# EAGLE design thermocouple_reader (EAGLE 6.5.0)
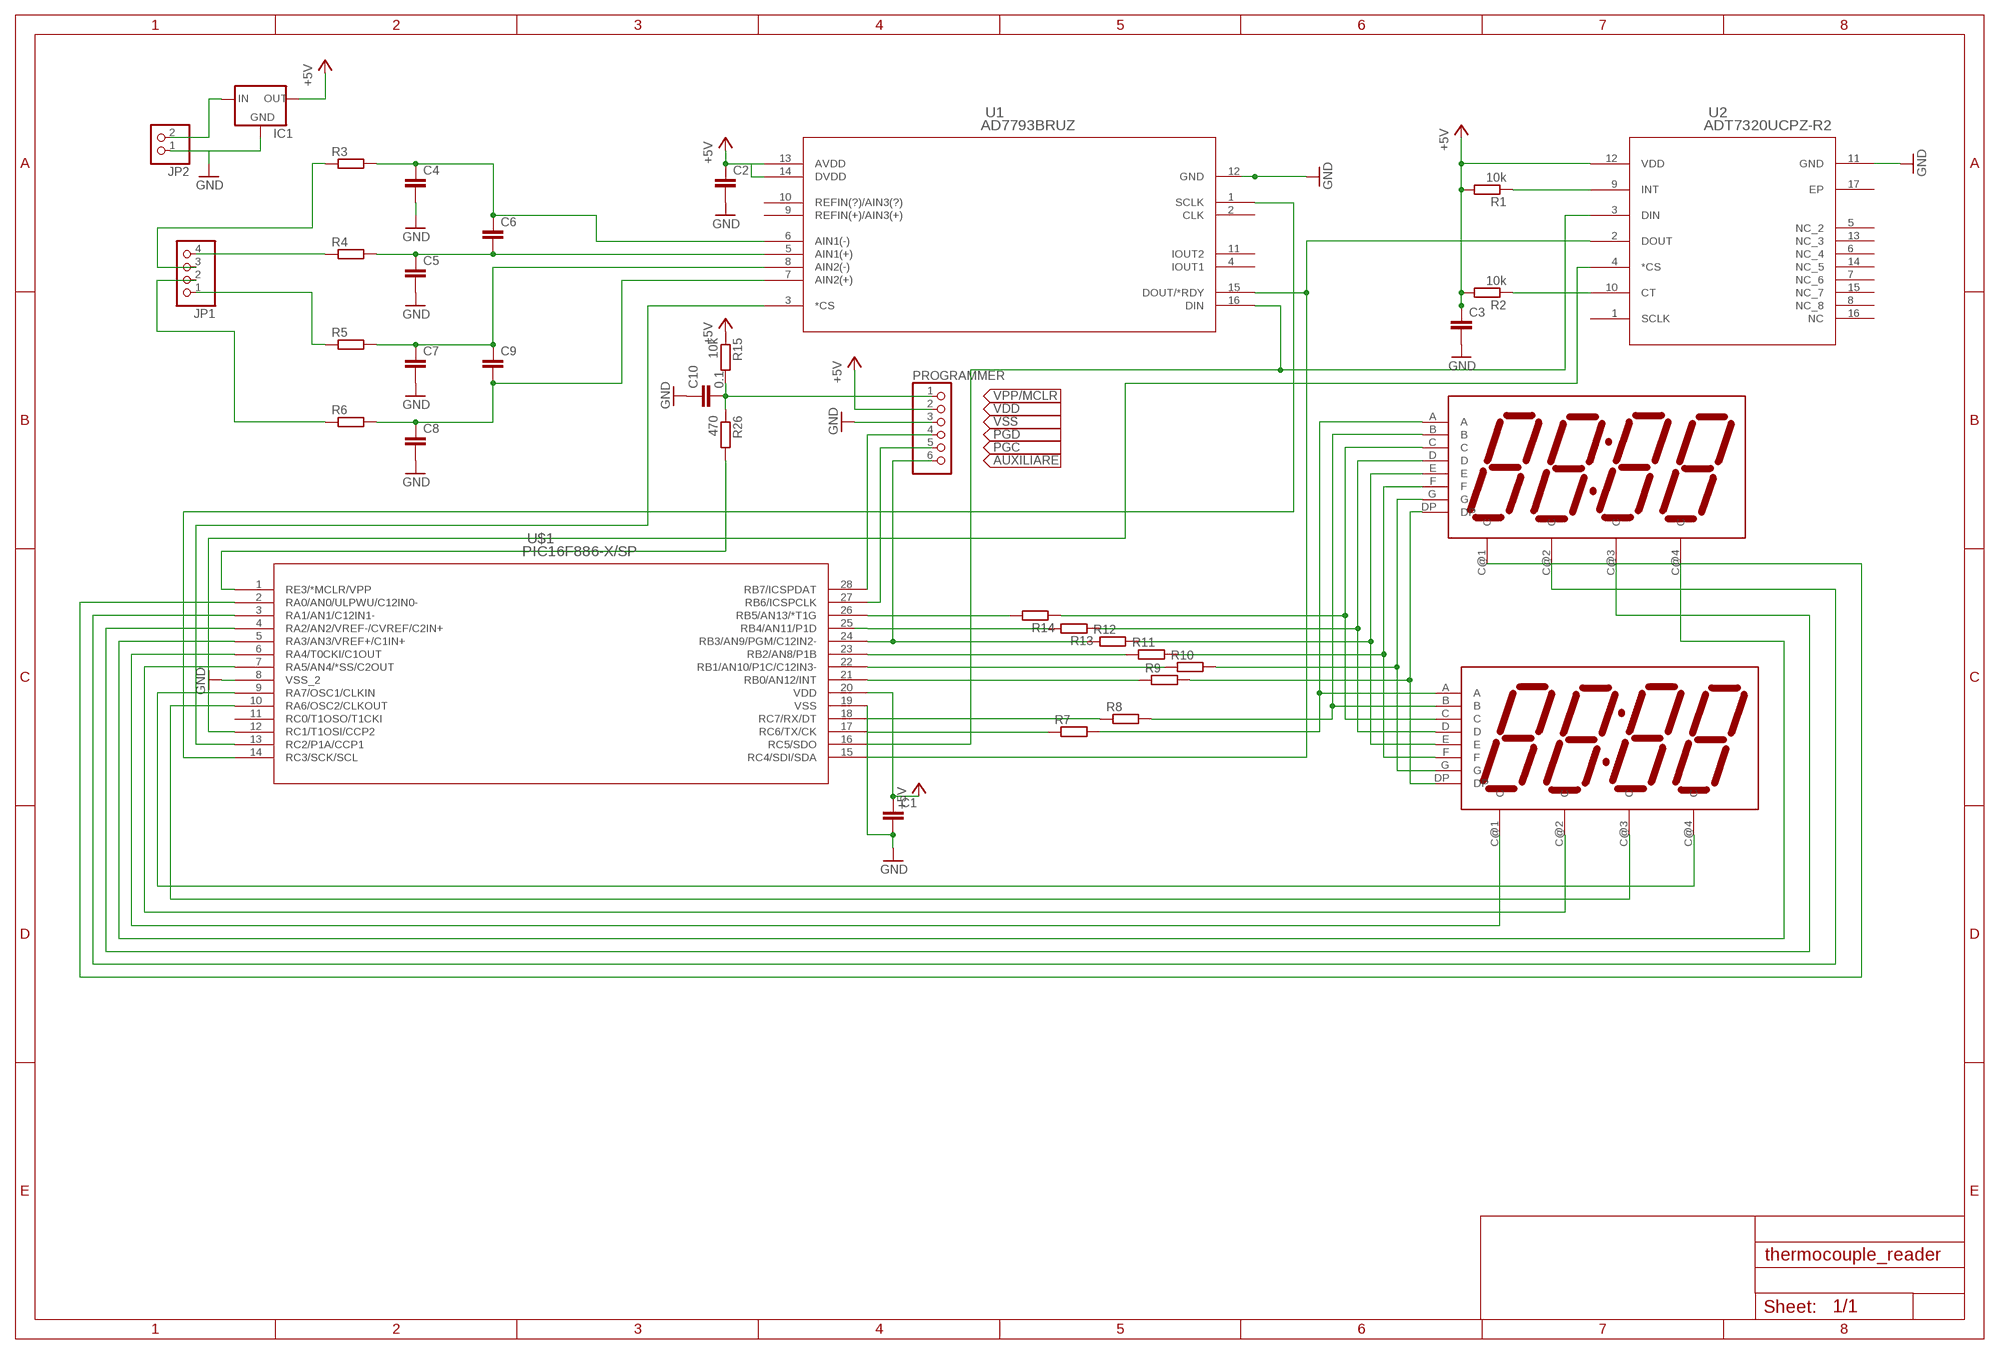
[diagram p0: schematic, sheet 1]

## Parts
C1  C-EU025-024X044  [C025-024X044]
C2  C-EU025-024X044  [C025-024X044]
C3  C-EU025-024X044  [C025-024X044]
C4  C-EU025-025X050  [C025-025X050]
C5  C-EU025-025X050  [C025-025X050]
C6  C-EU025-024X044  [C025-024X044]
C7  C-EU025-025X050  [C025-025X050]
C8  C-EU025-025X050  [C025-025X050]
C9  C-EU025-024X044  [C025-024X044]
C10  0.1  C-EU025-025X050  [C025-025X050]
IC1  78LXX  [78LXX]
JP1  PINHD-1X4  [1X04]
JP2  PINHD-1X2  [1X02]
PROGRAMMER  PINHD-1X6  [1X06]
R1  10k  R-EU_0204/5  [0204/5]
R2  10k  R-EU_0204/5  [0204/5]
R3  R-EU_0204/5  [0204/5]
R4  R-EU_0204/5  [0204/5]
R5  R-EU_0204/5  [0204/5]
R6  R-EU_0204/5  [0204/5]
R7  R-EU_0207/10  [0207/10]
R8  R-EU_0207/15  [0207/15]
R9  R-EU_0207/15  [0207/15]
R10  R-EU_0207/15  [0207/15]
R11  R-EU_0207/15  [0207/15]
R12  R-EU_0204/5  [0204/5]
R13  R-EU_0204/5  [0204/5]
R14  R-EU_0207/15  [0207/15]
R15  10k  R-EU_0204/5  [0204/5]
R26  470  R-EU_0204/5  [0204/5]
U1  AD7793BRUZ  [RU_16]
U2  ADT7320UCPZ-R2  [CP_16_17]
U$1  PIC16F886-X/SP  [SPDIP28_300MC]
U$2  HDSP-BO1E  [HDSP-B01]
U$3  HDSP-BO1E  [HDSP-B01]

## Nets
+5V: C1.1 C2.1 C3.1 IC1.OUT PROGRAMMER.2 R1.2 R2.2 R15.1 U1.13(AVDD) U1.14(DVDD) U2.12(VDD) U$1.20(VDD)
AUXILIARE: PROGRAMMER.6 R12.1 U$1.24(RB3/AN9/PGM/C12IN2-)
GND: C1.2 C2.2 C3.2 C4.2 C5.2 C7.2 C8.2 C10.1 IC1.GND JP2.1 PROGRAMMER.3 U1.12(GND) U2.11(GND) U$1.8(VSS_2) U$1.19(VSS)
N$1: C4.1 C6.1 R3.2 U1.6(AIN1(-))
N$2: U1.16(DIN) U2.3(DIN) U$1.16(RC5/SDO)
N$3: U1.1(SCLK) U$1.14(RC3/SCK/SCL)
N$4: U1.3(*CS) U$1.13(RC2/P1A/CCP1)
N$5: U2.4(*CS) U$1.12(RC1/T1OSI/CCP2)
N$6: U1.15(DOUT/*RDY) U2.2(DOUT) U$1.15(RC4/SDI/SDA)
N$7: C5.1 C6.2 R4.2 U1.5(AIN1(+))
N$8: C7.1 C9.1 R5.2 U1.8(AIN2(-))
N$9: R1.1 U2.9(INT)
N$10: R2.1 U2.10(CT)
N$11: C8.1 C9.2 R6.2 U1.7(AIN2(+))
N$12: R10.2 U$2.G U$3.G
N$13: R9.2 U$2.DP U$3.DP
N$14: R11.2 U$2.F U$3.F
N$15: R12.2 U$2.E U$3.E
N$16: R13.1 U$2.D U$3.D
N$17: R14.1 U$2.C U$3.C
N$18: R8.2 U$2.B U$3.B
N$19: R7.2 U$2.A U$3.A
N$20: R14.2 U$1.26(RB5/AN13/*T1G)
N$21: R13.2 U$1.25(RB4/AN11/P1D)
N$22: C10.2 PROGRAMMER.1 R15.2 R26.1
N$23: R11.1 U$1.23(RB2/AN8/P1B)
N$24: R10.1 U$1.22(RB1/AN10/P1C/C12IN3-)
N$25: R9.1 U$1.21(RB0/AN12/INT)
N$26: R8.1 U$1.18(RC7/RX/DT)
N$27: R7.1 U$1.17(RC6/TX/CK)
N$28: U$1.9(RA7/OSC1/CLKIN) U$3.C@4(C)
N$29: U$1.10(RA6/OSC2/CLKOUT) U$3.C@3(C)
N$30: U$1.7(RA5/AN4/*SS/C2OUT) U$3.C@2(C)
N$31: U$1.6(RA4/T0CKI/C1OUT) U$3.C@1(C)
N$32: U$1.5(RA3/AN3/VREF+/C1IN+) U$2.C@4(C)
N$33: U$1.4(RA2/AN2/VREF-/CVREF/C2IN+) U$2.C@3(C)
N$34: U$1.3(RA1/AN1/C12IN1-) U$2.C@2(C)
N$35: U$1.2(RA0/AN0/ULPWU/C12IN0-) U$2.C@1(C)
N$36: JP1.3 R3.1
N$37: JP1.4 R4.1
N$38: JP1.1 R5.1
N$39: JP1.2 R6.1
N$40: IC1.IN JP2.2
PGC: PROGRAMMER.5 U$1.27(RB6/ICSPCLK)
PGD: PROGRAMMER.4 U$1.28(RB7/ICSPDAT)
VPP/MCLR: R26.2 U$1.1(RE3/*MCLR/VPP)
Unconnected: U1.2(CLK) U1.4(IOUT1) U1.9(REFIN(+)/AIN3(+)) U1.10(REFIN(?)/AIN3(?)) U1.11(IOUT2) U2.1(SCLK) U2.5(NC_2) U2.6(NC_4) U2.7(NC_6) U2.8(NC_8) U2.13(NC_3) U2.14(NC_5) U2.15(NC_7) U2.16(NC) U2.17(EP) U$1.11(RC0/T1OSO/T1CKI)

## Library data of the parts
C1-C10 = rcl:C-EU: CAPACITOR, European symbol
IC1 = v-reg:78LXX: VOLTAGE REGULATOR
JP1 = pinhead:PINHD-1X4: PIN HEADER
JP2 = pinhead:PINHD-1X2: PIN HEADER
PROGRAMMER = pinhead:PINHD-1X6: PIN HEADER
R1-R15 R26 = rcl:R-EU_: RESISTOR, European symbol
U1 = AD7793:AD7793BRUZ
U2 = ADT7320:ADT7320UCPZ-R2
U$1 = PIC16F886:PIC16F886-X/SP
U$2 U$3 = led-7-segment:HDSP-BO1E: 4-digit 7-segment LED display red CC AVAGO

## Net classes
0 default: clearance 0.205 mm

## Board
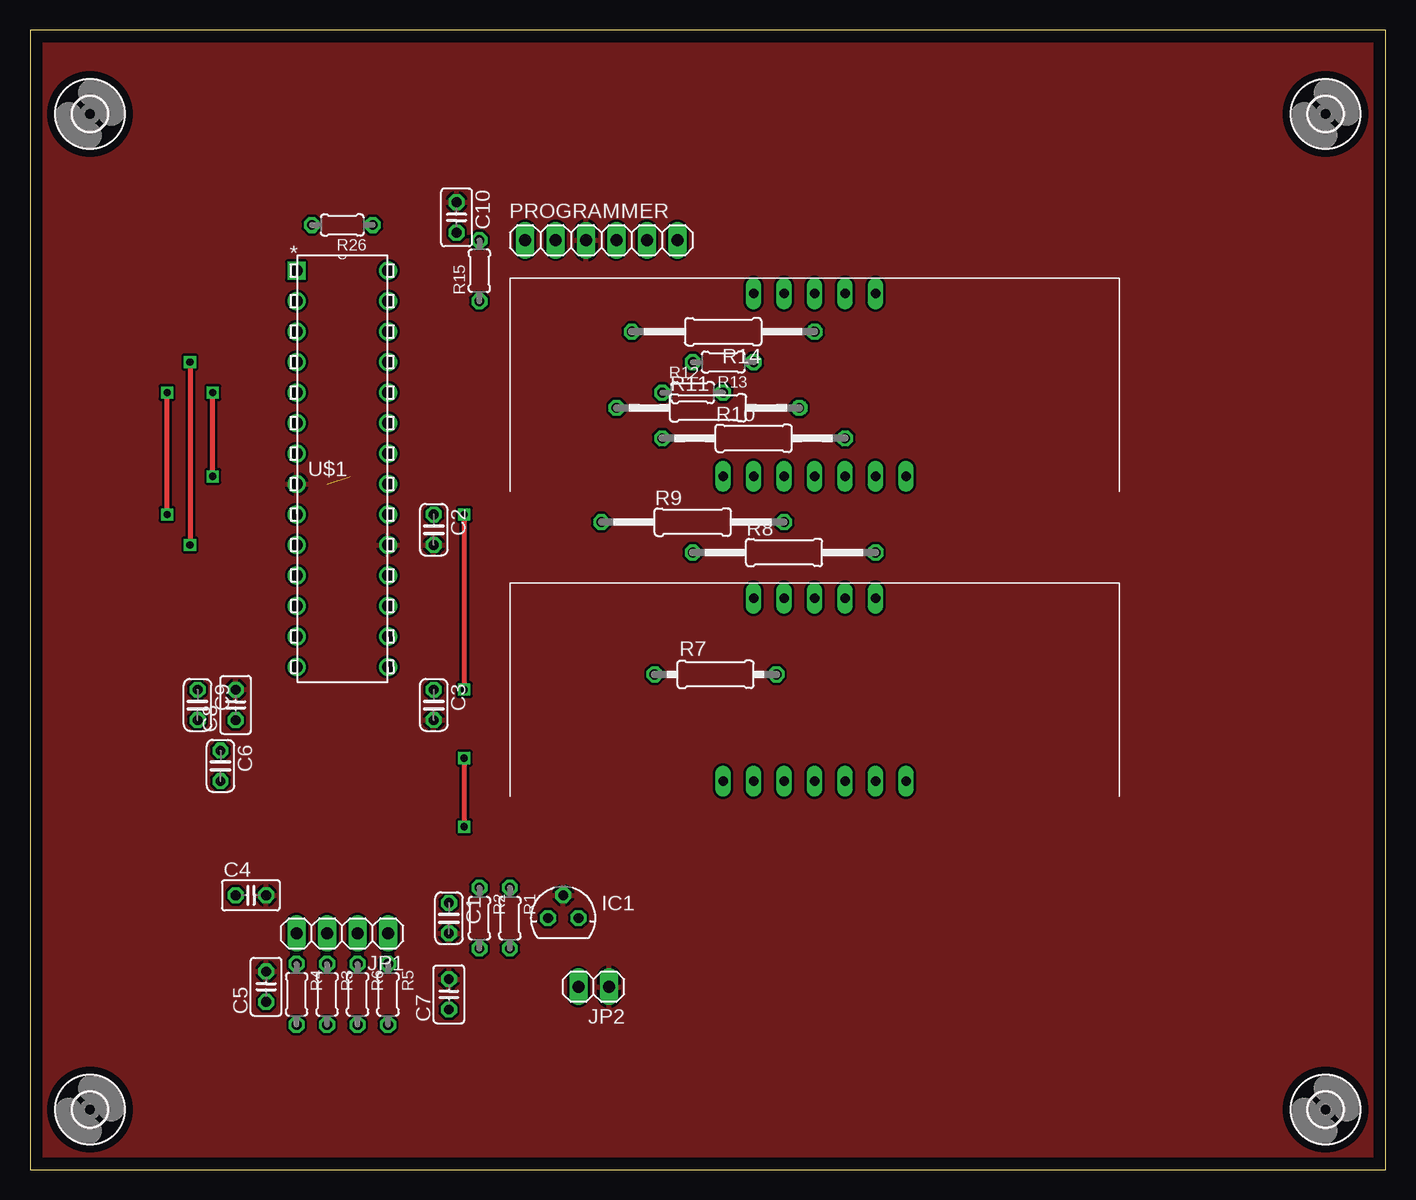
[diagram p1: board, top side]
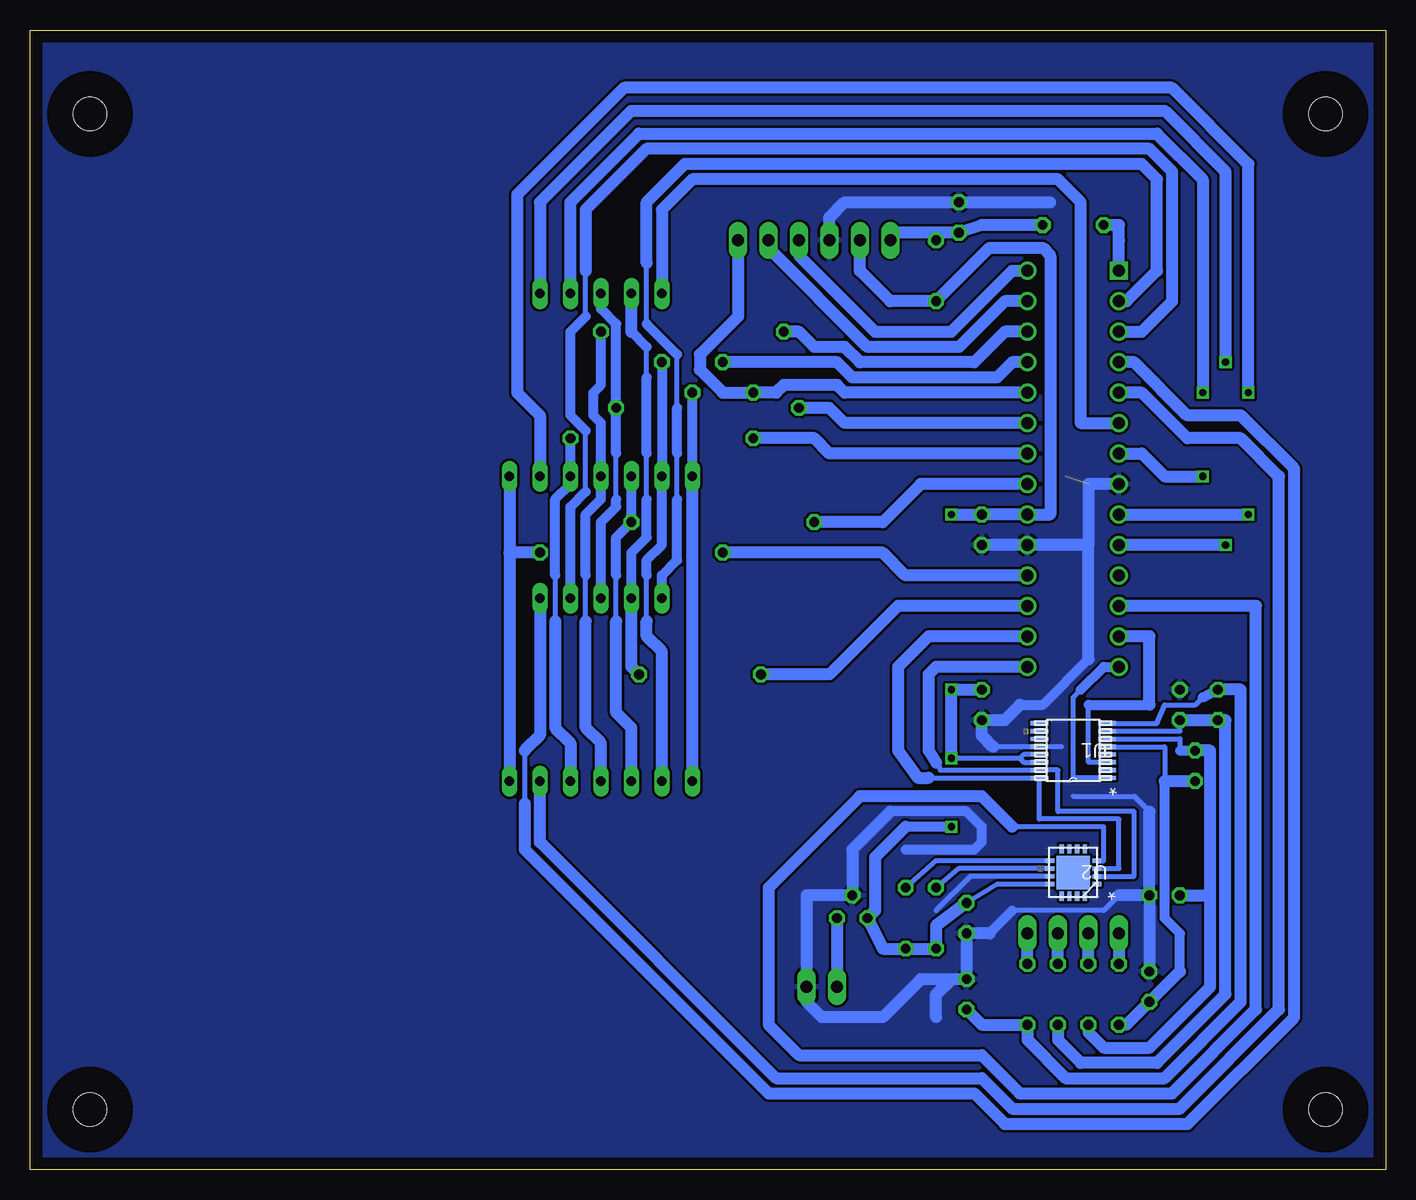
[diagram p2: board, bottom side, seen from below]

Size 113 x 95 mm. Coordinates in mm from the lower left corner, seen from the top.
Outline: 0,0 113,0 113,95 0,95 0,0
Copper layers (1*16): Top 0.035mm / dielectric 1.5mm / Bottom 0.035mm
Design rules "default": minimum track width 10mil, minimum drill 24mil, track to track 8mil, track to pad 8mil, pad to pad 8mil, via to via 8mil, smd to smd 8mil, copper to edge 40mil, drill to drill 8mil, minimum pad ring 10mil, minimum via ring 8mil, stop-mask expansion 4mil, vias tented up to drill 0mil, thermal gap 10mil

### Footprints (pad centres in the part's own frame; a part is rotated, then mirrored left to right if it is on the bottom)
C025-024X044 = drill 0.813 octagon: 1 -1.27,0; 2 1.27,0
C025-025X050 = drill 0.813 octagon: 1 -1.27,0; 2 1.27,0
78LXX = drill 0.813 octagon: GND 0,1.905; IN 1.27,0; OUT -1.27,0
1X04 = drill 1.016 long: 1 -3.81,0; 2 -1.27,0; 3 1.27,0; 4 3.81,0
1X02 = drill 1.016 long: 1 -1.27,0; 2 1.27,0
1X06 = drill 1.016 long: 1 -6.35,0; 2 -3.81,0; 3 -1.27,0; 4 1.27,0; 5 3.81,0; 6 6.35,0
0204/5 = drill 0.813 octagon: 1 -2.54,0; 2 2.54,0
0207/10 = drill 0.813 octagon: 1 -5.08,0; 2 5.08,0
0207/15 = drill 0.813 octagon: 1 -7.62,0; 2 7.62,0
RU_16 = smd 1.473 x 0.356: 1 -2.819,2.275; 2 -2.819,1.625; 3 -2.819,0.975; 4 -2.819,0.325; 5 -2.819,-0.325; 6 -2.819,-0.975; 7 -2.819,-1.625; 8 -2.819,-2.275; 9 2.819,-2.275; 10 2.819,-1.625; 11 2.819,-0.975; 12 2.819,-0.325; 13 2.819,0.325; 14 2.819,0.975; 15 2.819,1.625; 16 2.819,2.275
CP_16_17 = smd 0.762 x 0.356: 1 -1.968,0.975; 2 -1.968,0.325; 3 -1.968,-0.325; 4 -1.968,-0.975; 9 1.968,-0.975; 10 1.968,-0.325; 11 1.968,0.325; 12 1.968,0.975 | smd 0.356 x 0.762: 5 -0.975,-1.968; 6 -0.325,-1.968; 7 0.325,-1.968; 8 0.975,-1.968; 13 0.975,1.968; 14 0.325,1.968; 15 -0.325,1.968; 16 -0.975,1.968 | smd 2.794 x 2.794: 17 0,0
SPDIP28_300MC = drill 0.991 square: 1 -7.62,33.02 | drill 0.991: 2 -7.62,30.48; 3 -7.62,27.94; 4 -7.62,25.4; 5 -7.62,22.86; 6 -7.62,20.32; 7 -7.62,17.78; 8 -7.62,15.24; 9 -7.62,12.7; 10 -7.62,10.16; 11 -7.62,7.62; 12 -7.62,5.08; 13 -7.62,2.54; 14 -7.62,0; 15 0,0; 16 0,2.54; 17 0,5.08; 18 0,7.62; 19 0,10.16; 20 0,12.7; 21 0,15.24; 22 0,17.78; 23 0,20.32; 24 0,22.86; 25 0,25.4; 26 0,27.94; 27 0,30.48; 28 0,33.02
HDSP-B01 = drill 0.8 long: A 22.86,16.51; B 33.02,1.27; C 25.4,1.27; C@1 20.32,16.51; C@2 27.94,16.51; C@3 30.48,16.51; C@4 30.48,1.27; D 20.32,1.27; DP 22.86,1.27; E 17.78,1.27; F 25.4,16.51; G 27.94,1.27
2,8 = hole 2.8: 0,0

### Placement (x,y rotation side)
C1  34.92,20.95 270 top
C2  33.66,53.34 270 top
C3  33.66,38.73 270 top
C4  18.41,22.86 0 top
C5  19.68,15.24 90 top
C6  15.88,33.66 270 top
C7  34.92,14.61 90 top
C8  17.14,38.73 90 top
C9  13.97,38.73 270 top
C10  35.56,79.38 270 top
IC1  44.45,20.95 0 top
JP1  26.04,19.68 180 top
JP2  46.99,15.24 180 top
PROGRAMMER  47.62,77.47 0 top
R1  40.01,20.95 270 top
R2  37.47,20.95 270 top
R3  24.77,14.61 270 top
R4  22.23,14.61 270 top
R5  29.84,14.61 270 top
R6  27.3,14.61 270 top
R7  57.15,41.27 0 top
R8  62.87,51.44 0 top
R9  55.24,53.98 0 top
R10  60.33,60.96 0 top
R11  56.52,63.5 0 top
R12  55.24,64.77 0 top
R13  57.78,67.31 180 top
R14  57.78,69.85 180 top
R15  37.47,74.93 90 top
R26  26.04,78.74 180 top
U1  26.04,34.92 180 bottom
U2  26.04,24.77 180 bottom
U$1  29.84,41.91 0 top
U$2  40.01,31.11 0 top
U$3  40.01,56.52 0 top
U$4  [2,8]  5,88 0 top
U$5  [2,8]  5,5 0 top
U$6  [2,8]  108,5 0 top
U$7  [2,8]  108,88 0 top

### Tracks (layer width: path | path; a pad name or v marks a point on that pad's centre or on a via)
+5V  (via drill 0.6)
  Top 0.406: v36.2,34.29 v36.2,28.57 | v36.2,54.61 v36.2,40.01
  Bottom 0.406: U2.12 32.38,23.79 C1.1 | R2.2 R1.2 | U1.13 30.17,34.6 30.48,34.29 | 30.48,34.29 30.14,33.95 U1.14 29.21,33.95 | 30.48,34.29 v36.2,34.29
  Bottom 0.813: v36.2,28.57 40.01,28.57
  Bottom 1.016: C1.1 37.47,20.32 R2.2 41.91,18.41 IC1.OUT 42.55,21.59 42.55,26.04 40.01,28.57 | v36.2,54.61 C2.1 U$1.20 27.94,54.61 27.94,76.2 28.57,76.83 33.02,76.83 R15.1 41.27,72.39 43.81,74.93 PROGRAMMER.2 | C3.1 v36.2,40.01 v36.2,34.29
AUXILIARE
  Bottom 1.016: U$1.24 45.09,64.77 45.72,65.41 50.16,65.41 50.8,64.77 R12.1 55.24,64.77 57.15,66.67 57.15,67.94 53.98,71.12 PROGRAMMER.6
GND  (1 unrouted)
  Bottom 0.406: 22.23,22.86 23.5,21.59 31.11,21.59 | 36.2,15.88 C7.2 | U2.11 34.62,24.44 37.47,21.59 | 32.71,35.25 U1.12 27,35.25 | 19.68,29.84 20.95,31.11 26.04,31.11
  Bottom 0.813: 31.11,21.59 33.02,19.68 | 40.01,26.67 34.29,26.67 33.66,27.3 33.66,28.57 34.92,29.84 41.27,29.84 | 30.48,38.73 28.57,38.73 24.77,42.55
  Bottom 1.016: C2.2 U$1.19 24.77,52.07 | C4.2 C5.2 | C4.2 22.23,22.86 | 33.02,19.68 C1.2 C7.2 38.73,15.88 41.91,12.7 46.99,12.7 48.26,13.97 JP2.1 48.26,22.86 IC1.GND 44.45,26.67 41.27,29.84 | 37.47,12.7 37.47,14.61 36.2,15.88 | 32.71,35.25 33.66,36.2 C3.2 31.75,37.47 30.48,38.73 | 24.77,42.55 24.77,52.07 | C4.2 19.68,29.84 | PROGRAMMER.3 46.35,79.38 45.09,80.64 27.94,80.64 | U$1.8 24.77,57.15 24.77,52.07
  pour Bottom: 0.64,93.98 0.64,0.64 111.76,0.64 112.39,94.61
  pour Top: 0.64,94 0.64,0 112.36,0.64 113.64,94
N$1
  Bottom 0.406: U1.6 17.14,35.9 17.14,34.92
  Bottom 0.813: 17.14,34.92 C6.1
  Bottom 1.016: R3.2 24.77,11.43 23.5,10.16 19.68,10.16 14.61,15.24 14.61,22.86 | 14.61,22.86 14.61,34.92 C6.1 | C4.1 14.61,22.86
N$2
  Bottom 0.406: U2.3 22.23,25.09 22.23,29.21 28.85,29.21 U1.16 38.1,32.65
  Bottom 1.016: U$1.16 38.1,44.45 40.64,41.91 40.64,34.92 39,32.65 38.1,32.65
N$3
  Bottom 0.406: U1.1 26.04,32.65 26.04,39.37 25.4,40.01
  Bottom 0.813: 25.4,40.01 23.5,41.91 U$1.14
N$4
  Bottom 0.406: U1.3 24.77,33.95 24.77,38.73
  Bottom 0.813: 24.77,38.73 19.68,38.73
  Bottom 1.016: 19.68,38.73 19.68,44.45 U$1.13
N$5
  Bottom 0.406: U2.4 23.5,25.74 23.5,28.57 31.11,28.57
  Bottom 1.016: 31.11,28.57 33.66,31.11 43.81,31.11 51.44,23.5 51.44,12.06 48.9,9.53 33.66,9.53 30.48,6.35 17.78,6.35 10.79,13.34 10.79,46.99 U$1.12
N$6
  Bottom 0.406: U2.2 20.95,24.44 20.95,29.84 27.3,29.84 27.3,33.3 U1.15 37.11,33.3 37.47,34.29 37.47,33.94
  Bottom 1.016: U$1.15 37.47,41.91 38.1,41.27 38.1,34.92 37.47,33.94
N$7
  Bottom 0.406: U1.5 18.41,35.25 18.41,32.38
  Bottom 0.813: 17.14,16.51 17.14,19.68 18.41,20.95 18.41,32.38
  Bottom 1.016: 17.14,16.51 C5.1 21.59,12.06 R4.2 | 18.41,32.38 C6.2
N$8
  Bottom 0.406: U1.8 19.05,37.2 18.41,38.73 15.88,38.73 15.24,39.37
  Bottom 0.813: 15.24,39.37 C9.1
  Bottom 1.016: C9.1 12.06,40.01 12.06,13.97 18.41,7.62 26.67,7.62 29.84,10.79 R5.2 33.66,12.06 C7.1
N$9
  Bottom 0.406: U2.9 37.47,25.74 R1.1
N$10
  Bottom 0.406: U2.10 35.56,25.09 R2.1
N$11
  Bottom 0.406: U1.7 17.14,36.55 C8.1
  Bottom 1.016: R6.2 27.3,10.79 25.4,8.89 19.05,8.89 13.34,14.61 13.34,37.47 C9.2 C8.1
N$12
  Bottom 0.406: 69.22,49.53 69.22,45.72 | 67.94,57.15 U$3.G
  Bottom 0.813: 69.22,49.53 69.22,55.88 67.94,57.15 | U$3.G R10.2
  Bottom 1.016: 69.22,45.72 69.22,36.83 67.94,35.56 U$2.G
N$13
  Bottom 0.406: 64.14,45.72 64.14,49.53
  Bottom 0.813: 64.14,49.53 64.14,52.7 R9.2 U$3.DP
  Bottom 1.016: U$2.DP 62.87,36.83 64.14,38.1 64.14,45.72
N$14  (via drill 0.6)
  Bottom 0.406: 64.14,55.88 64.14,59.69 R11.2
  Bottom 0.813: U$2.F 65.41,53.98 64.14,55.24 64.14,55.88 | U$3.F 65.41,71.75 64.14,70.48 64.14,59.69
  other vias: 64.14,63.5
N$15
  Bottom 0.813: U$3.E R12.2
  Bottom 1.016: U$2.E U$3.E
N$16
  Bottom 0.406: 61.59,45.72 61.59,49.53
  Bottom 0.813: 61.59,49.53 61.59,50.8 60.33,52.07 U$3.D R13.1
  Bottom 1.016: U$2.D 60.33,43.18 61.59,44.45 61.59,45.72
N$17  (via drill 0.6)
  Bottom 0.406: 66.67,45.72 66.67,49.53
  Bottom 0.813: 66.67,49.53 66.67,54.61 65.41,55.88 U$3.C 65.41,62.23 66.04,62.87 66.04,64.77 65.41,65.41 R14.1
  Bottom 1.016: U$2.C 65.41,35.56 66.67,36.83 66.67,45.72
  other vias: 65.41,69.85
N$18
  Bottom 1.016: U$3.B 73.03,51.44 | 73.03,51.44 U$2.B | R8.2 73.03,51.44
N$19
  Bottom 0.406: 61.59,55.88 61.59,59.69 | 61.59,66.04 61.59,68.58
  Bottom 0.813: U$2.A 62.87,51.44 61.59,52.7 61.59,55.88 | 61.59,68.58 62.87,69.85 | 61.59,59.69 61.59,66.04
  Bottom 1.016: 62.87,69.85 U$3.A | R7.2 62.87,41.91 U$2.A
N$20
  Bottom 1.016: U$1.26 31.75,69.85 34.29,67.31 43.81,67.31 45.09,68.58 47.62,68.58 48.9,69.85 R14.2
N$21
  Bottom 1.016: U$1.25 31.11,67.31 32.38,66.04 44.45,66.04 45.72,67.31 R13.2
N$22
  Bottom 1.016: R26.1 33.66,78.74 C10.2 37.47,78.11 | R15.2 37.47,78.11 | 37.47,78.11 41.27,78.11 PROGRAMMER.1
N$23
  Bottom 1.016: U$1.23 45.09,62.23 46.35,63.5 R11.1
N$24
  Bottom 1.016: U$1.22 46.35,59.69 47.62,60.96 R10.1
N$25
  Bottom 1.016: U$1.21 38.73,57.15 41.91,53.98 R9.1
N$26
  Bottom 1.016: U$1.18 40.01,49.53 41.91,51.44 R8.1
N$27
  Bottom 1.016: U$1.17 40.64,46.99 46.35,41.27 R7.1
N$28  (via drill 0.6)
  Top 0.406: v11.43,54.61 v11.43,64.77
  Bottom 1.016: U$1.9 v11.43,54.61 | v11.43,64.77 11.43,83.82 17.78,90.17 63.5,90.17 72.39,81.28 72.39,64.77 70.48,62.87 U$3.C@4
N$29  (via drill 0.6)
  Top 0.406: v13.34,67.31 v13.34,52.07
  Bottom 1.016: v13.34,67.31 13.34,83.19 18.41,88.27 62.87,88.27 70.48,80.64 U$3.C@3 | v13.34,52.07 U$1.10
N$30  (via drill 0.6)
  Top 0.406: v15.24,57.78 v15.24,64.77
  Bottom 1.016: U$3.C@2 67.94,80.64 62.23,86.36 19.05,86.36 15.24,82.55 v15.24,64.77 | U$1.7 20.32,59.69 18.41,57.78 v15.24,57.78
N$31
  Bottom 1.016: U$1.6 25.4,62.23 25.4,80.64 27.3,82.55 57.78,82.55 60.33,80.01 U$3.C@1
N$32
  Bottom 1.016: U$1.5 20.32,64.77 16.51,60.96 12.06,60.96 8.89,57.78 8.89,13.34 17.14,5.08 31.11,5.08 33.66,7.62 50.8,7.62 70.48,27.3 U$2.C@4
N$33
  Bottom 0.406: 71.75,34.92 71.75,30.48
  Bottom 1.016: 71.75,30.48 71.75,26.67 51.44,6.35 34.29,6.35 31.75,3.81 16.51,3.81 7.62,12.7 7.62,58.42 12.06,62.87 16.51,62.87 20.95,67.31 U$1.4 | U$2.C@3 70.48,36.2 71.75,34.92
N$34
  Bottom 0.406: 66.67,56.52 66.67,61.59 | 66.67,71.12 66.67,74.93
  Bottom 0.813: U$2.C@2 67.94,55.24 66.67,56.52 | 66.67,61.59 67.94,62.87 67.94,69.85 66.67,71.12
  Bottom 1.016: U$1.3 20.32,69.85 17.78,72.39 17.78,83.19 19.68,85.09 61.59,85.09 66.67,80.01 66.67,74.93
N$35
  Bottom 0.406: U$1.2 21.59,72.39 | 59.05,55.88 59.05,59.69 | 59.05,63.5 59.05,67.94 | 61.59,70.48 61.59,75.56
  Bottom 0.813: U$2.C@1 60.33,49.53 59.05,50.8 59.05,55.88 | 59.05,67.94 61.59,70.48 | 59.05,59.69 59.05,63.5
  Bottom 1.016: 21.59,72.39 19.05,74.93 19.05,82.55 20.32,83.82 58.42,83.82 61.59,80.64 61.59,75.56
N$36
  Bottom 1.016: R3.1 JP1.3
N$37
  Bottom 1.016: JP1.4 R4.1
N$38
  Bottom 1.016: R5.1 JP1.1
N$39
  Bottom 1.016: R6.1 JP1.2
N$40
  Bottom 1.016: IC1.IN JP2.2
PGC
  Bottom 1.016: PROGRAMMER.5 51.44,76.83 43.18,68.58 35.56,68.58 31.75,72.39 U$1.27
PGD
  Bottom 1.016: PROGRAMMER.4 48.9,76.2 42.55,69.85 36.2,69.85 31.11,74.93 U$1.28
VPP/MCLR
  Bottom 1.016: U$1.1 22.23,77.47 22.23,78.74 R26.2